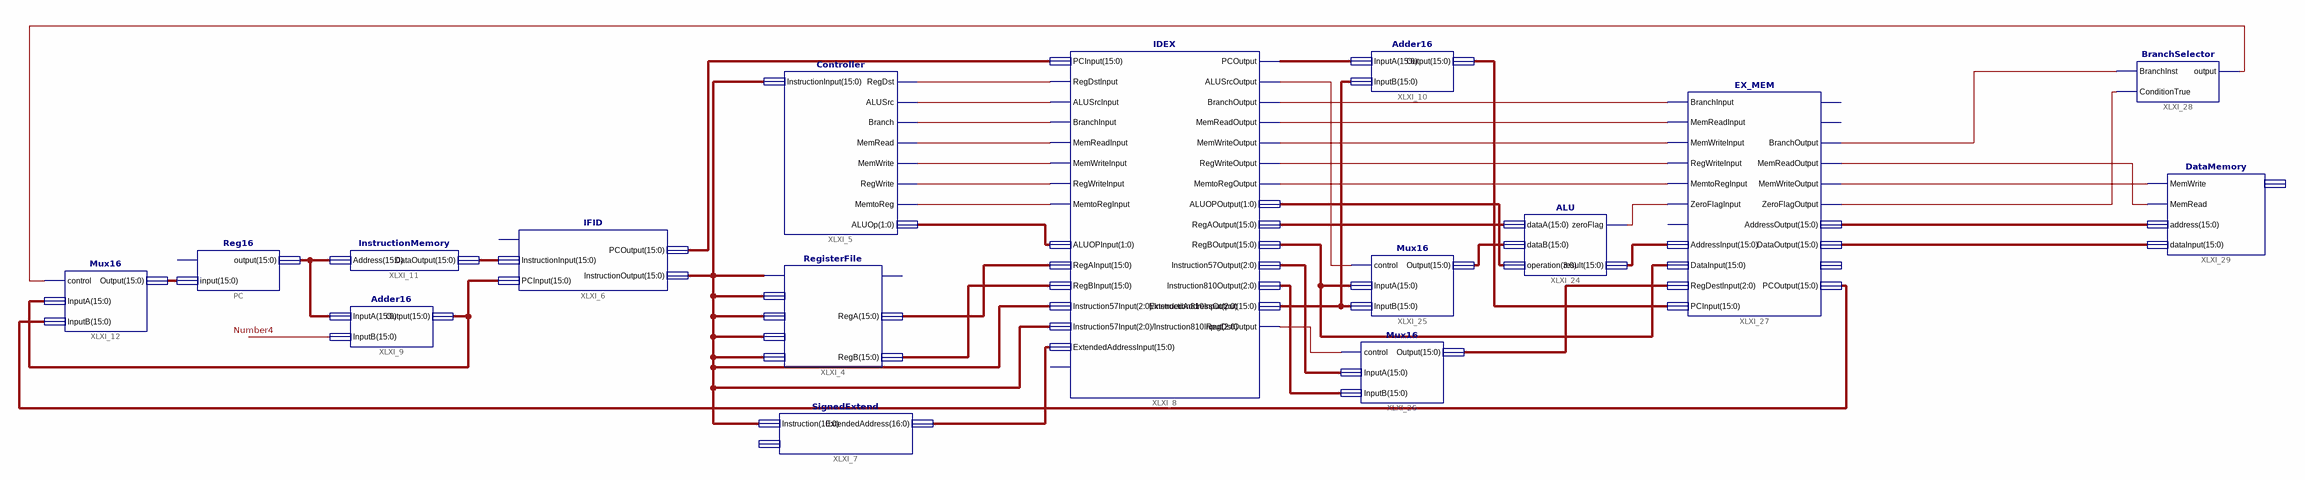
[diagram p0: schematic sheet 1]
// Xilinx ISE schematic Project2.sch (spartan3e) as structural Verilog: 16 symbols, 0 ports
module Project2 (
);

  wire Number4, XLXN_33, XLXN_35, XLXN_36, XLXN_37, XLXN_38, XLXN_39, XLXN_40, XLXN_153, XLXN_184, XLXN_198,
       XLXN_199, XLXN_200, XLXN_202, XLXN_203, XLXN_210, XLXN_211, XLXN_212, XLXN_213, XLXN_216, XLXN_253;
  wire [1:0] XLXN_41, XLXN_171;
  wire [2:0] XLXN_185, XLXN_186;
  wire [10:0] XLXN_79;
  wire [15:0] XLXN_34, XLXN_42, XLXN_43, XLXN_80, XLXN_118, XLXN_119, XLXN_149, XLXN_150, XLXN_152, XLXN_169,
       XLXN_204, XLXN_205, XLXN_208, XLXN_209, XLXN_214, XLXN_215, XLXN_252, XLXN_254;
  wire [16:0] XLXN_44;

  SignedExtend XLXI_7 (.Instruction(XLXN_79), .ExtendedAddress(XLXN_44));  // open: Selector
  IDEX XLXI_8 (
    .RegDstInput(XLXN_33), .ALUSrcInput(XLXN_35), .BranchInput(XLXN_36), .MemReadInput(XLXN_37),
    .MemWriteInput(XLXN_38), .RegWriteInput(XLXN_39), .MemtoRegInput(XLXN_40), .RegDstOutput(XLXN_184),
    .ALUOPInput(XLXN_41), .RegAInput(XLXN_42), .RegBInput(XLXN_43), .Instruction57Input(XLXN_79),
    .Instruction810Input(XLXN_79), .ExtendedAddressInput(XLXN_44), .PCOutput(XLXN_149),
    .ALUSrcOutput(XLXN_153), .BranchOutput(XLXN_198), .MemReadOutput(XLXN_199), .MemWriteOutput(XLXN_200),
    .RegWriteOutput(XLXN_202), .MemtoRegOutput(XLXN_203), .ALUOPOutput(XLXN_171), .RegAOutput(XLXN_169),
    .RegBOutput(XLXN_204), .Instruction57Output(XLXN_185), .Instruction810Output(XLXN_186),
    .ExtendedAddressOutput(XLXN_150), .PCInput(XLXN_34));  // open: clock
  RegisterFile XLXI_4 (
    .RegWrite(XLXN_79), .SelectA(XLXN_79), .SelectB(XLXN_79), .SelectC(XLXN_79), .InputData(XLXN_79),
    .RegA(XLXN_42), .RegB(XLXN_43));  // open: EqualFlag
  Controller XLXI_5 (
    .InstructionInput(XLXN_79), .RegDst(XLXN_33), .ALUSrc(XLXN_35), .Branch(XLXN_36), .MemRead(XLXN_37),
    .MemWrite(XLXN_38), .RegWrite(XLXN_39), .MemtoReg(XLXN_40), .ALUOp(XLXN_41));
  IFID XLXI_6 (
    .InstructionInput(XLXN_80), .PCInput(XLXN_209), .PCOutput(XLXN_34), .InstructionOutput(XLXN_79));  // open: clock
  Adder16 XLXI_10 (.InputA(XLXN_149), .InputB(XLXN_150), .Output(XLXN_254));
  Adder16 XLXI_9 (.InputA(XLXN_119), .InputB({16{Number4}}), .Output(XLXN_209));
  InstructionMemory XLXI_11 (.Address(XLXN_119), .DataOutput(XLXN_80));
  Mux16 XLXI_12 (.control(XLXN_216), .InputA(XLXN_209), .InputB(XLXN_208), .Output(XLXN_118));
  Reg16 PC (.\input (XLXN_118), .\output (XLXN_119));  // open: clk
  ALU XLXI_24 (.dataA(XLXN_169), .dataB(XLXN_152), .operation(XLXN_171), .zeroFlag(XLXN_253), .result(XLXN_252));
  Mux16 XLXI_25 (.control(XLXN_153), .InputA(XLXN_204), .InputB(XLXN_150), .Output(XLXN_152));
  Mux16 XLXI_26 (.control(XLXN_184), .InputA(XLXN_185), .InputB(XLXN_186), .Output(XLXN_205));
  EX_MEM XLXI_27 (
    .BranchInput(XLXN_198), .MemReadInput(XLXN_199), .MemWriteInput(XLXN_200), .RegWriteInput(XLXN_202),
    .MemtoRegInput(XLXN_203), .ZeroFlagInput(XLXN_253), .AddressInput(XLXN_252), .DataInput(XLXN_204),
    .RegDestInput(XLXN_205), .PCInput(XLXN_254), .BranchOutput(XLXN_210), .MemReadOutput(XLXN_213),
    .MemWriteOutput(XLXN_212), .ZeroFlagOutput(XLXN_211), .AddressOutput(XLXN_214), .DataOutput(XLXN_215),
    .PCOutput(XLXN_208));  // open: clock, MemtoRegOutput, RegWriteOutput, RegDestOutput
  BranchSelector XLXI_28 (.BranchInst(XLXN_210), .ConditionTrue(XLXN_211), .\output (XLXN_216));
  DataMemory XLXI_29 (
    .MemWrite(XLXN_212), .MemRead(XLXN_213), .address(XLXN_214), .dataInput(XLXN_215));  // open: output
endmodule
